# Altium project Sensors.PrjPCB
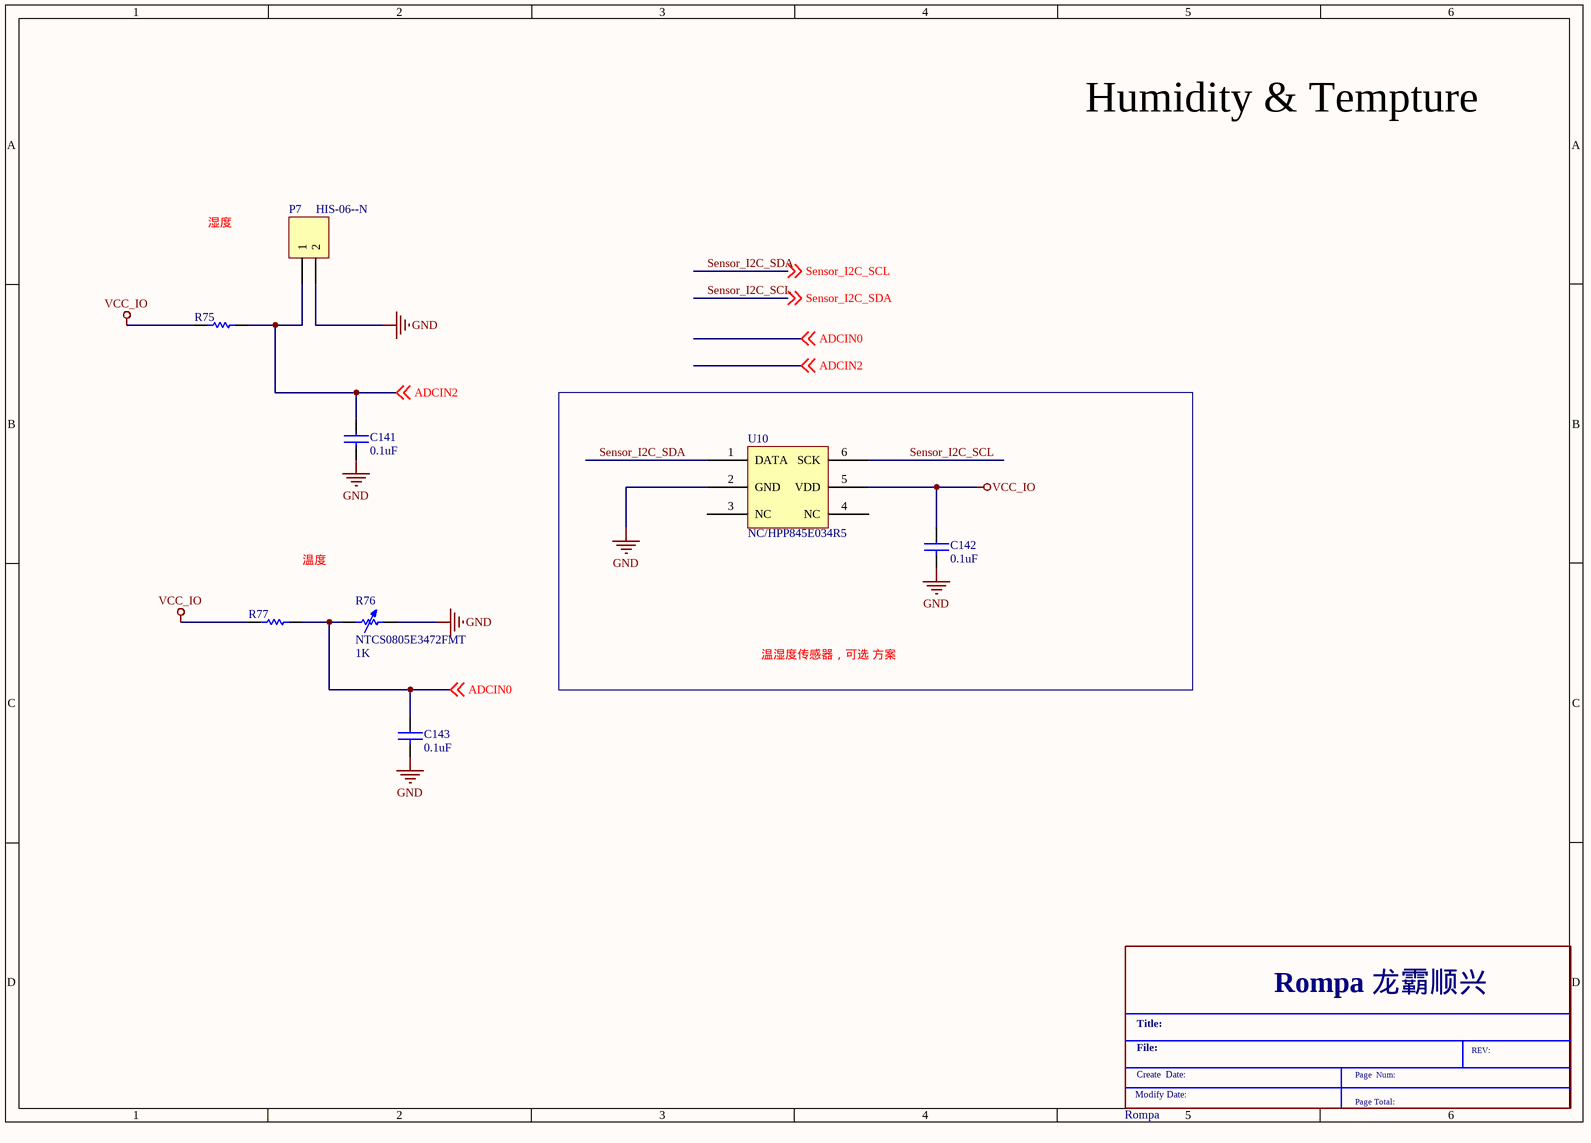
[diagram p0: Option_Humidity_Tempture_Sensor.SchDoc]
3 sheets, 20 parts. Net scope: global (net labels, ports and power ports of the same name join across sheets).
Sheets:
  Option_Humidity_Tempture_Sensor.SchDoc
  Option_LighterSensor.SchDoc
  Option_MotionSensor.SchDoc

## Sheet Option_Humidity_Tempture_Sensor.SchDoc
size 297 x 209 mm

### Parts
(Parts that share a designator on the sheet are numbered #1, #2 ... from top to bottom, then left to right.)
*#1  Rompa  (graphical)
C141  0.1uF  [C0402]
C142  0.1uF  [C0402]
C143  0.1uF  [C0402]
P7  HIS-06--N  [HDR1X2]
R75  10K  [0603]  (value not drawn)
R76  NTCS0805E3472FMT  value 1K  [2012[0805]]
R77  10K  [0603]  (value not drawn)
U10  NC/HPP845E034R5

### Blocks framed on the sheet
温湿度传感器，可选 方案: C142 U10

### Nets
GND: C141.2 C142.2 C143.2 P7.2 R76.2 U10.2(GND)
VCC_IO: C142.1 R75.2 R77.2 U10.5(VDD)
ADCIN0: C143.1 R76.1 R77.1 ; off-sheet ADCIN0
ADCIN2: C141.1 P7.1 R75.1 ; off-sheet ADCIN2
Sensor_I2C_SCL: U10.1(DATA) U10.6(SCK) ; off-sheet Sensor_I2C_SDA, off-sheet Sensor_I2C_SCL  [also labelled Sensor_I2C_SDA]

Not connected (* = marked no-connect by the designer): U10 3(NC) 4(NC)

### Notes on the sheet
- Humidity & Tempture
- 湿度
- 温度
- (in symbol Rompa) Rompa 龙霸顺兴; Title:; File:; REV:; Create  Date:; Page  Num:; Modify Date:; Page Total:

### Library data of the parts
C141-C143 = CAP NP
P7 = Header 2: Humidity Resistor; LatestRevisionDate: 17-Jul-2002; LatestRevisionNote: Re-released for DXP Platform.; Publisher: Altium Limited
R75 R77 = Res1: Resistor; Published: 8-Jun-2000; LatestRevisionDate: 17-Jul-2002; LatestRevisionNote: Re-released for DXP Platform.; PackageReference: AXIAL-0.3; Publisher: Altium Limited; Value: 10K
R76 = Res Adj1: 4K7 NTC 1%; Set Position: 0.5; Published: 8-Jun-2000; LatestRevisionDate: 17-Jul-2002; LatestRevisionNote: Re-released for DXP Platform.; PackageReference: AXIAL-0.7; Publisher: Altium Limited
U10 = HPP845E034R5

## Sheet Option_LighterSensor.SchDoc
size 297 x 209 mm
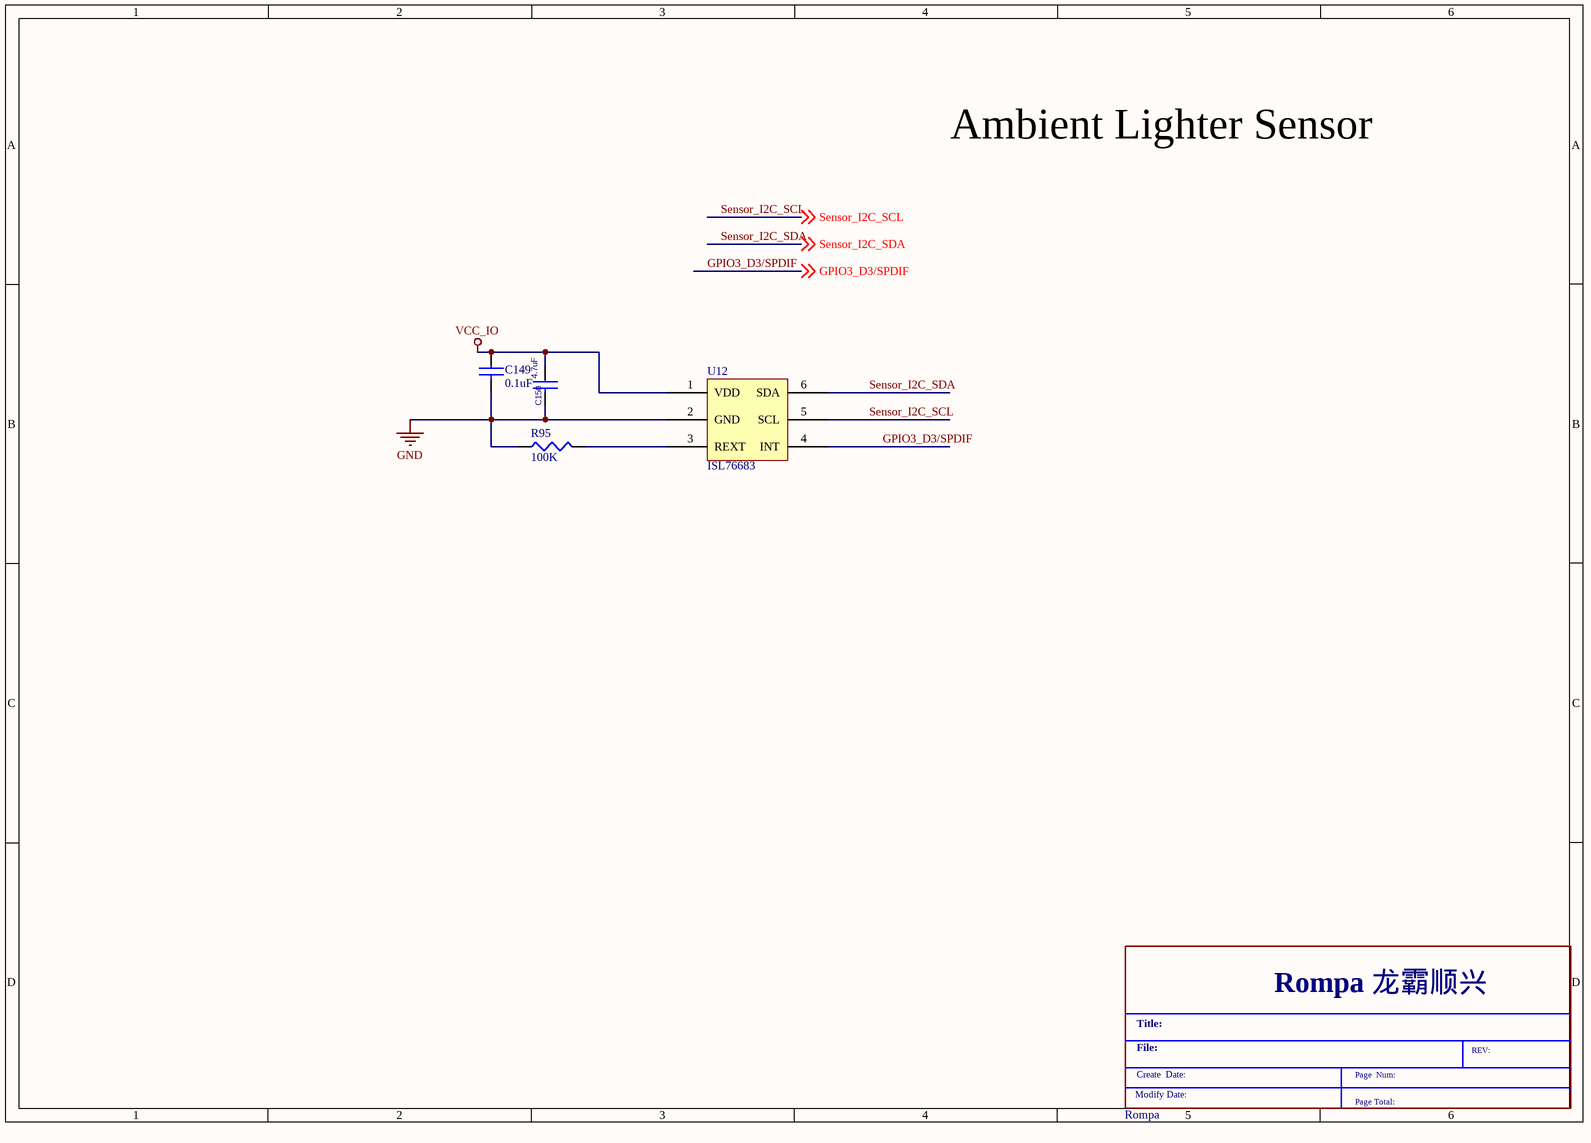
[diagram p1: Option_LighterSensor.SchDoc]

### Parts
(Parts that share a designator on the sheet are numbered #1, #2 ... from top to bottom, then left to right.)
*#2  Rompa  (graphical)
C149  0.1uF  [C0402]
C150  4.7uF  [C0603]
R95  100K  [R0402]
U12  ISL76683

### Nets
GND: C149.2 C150.2 R95.1 U12.2(GND)
VCC_IO: C149.1 C150.1 U12.1(VDD)
GPIO3_D3/SPDIF: U12.4(INT) ; off-sheet GPIO3_D3/SPDIF
Sensor_I2C_SCL: U12.5(SCL) U12.6(SDA) ; off-sheet Sensor_I2C_SDA, off-sheet Sensor_I2C_SCL  [also labelled Sensor_I2C_SDA]
NetR95_2: R95.2 U12.3(REXT)

### Notes on the sheet
- Ambient Lighter Sensor
- (in symbol Rompa) Rompa 龙霸顺兴; Title:; File:; REV:; Create  Date:; Page  Num:; Modify Date:; Page Total:

### Library data of the parts
C149 = CAP NP
C150 = CAP NP_4
R95 = RESISTOR

## Sheet Option_MotionSensor.SchDoc
size 297 x 209 mm
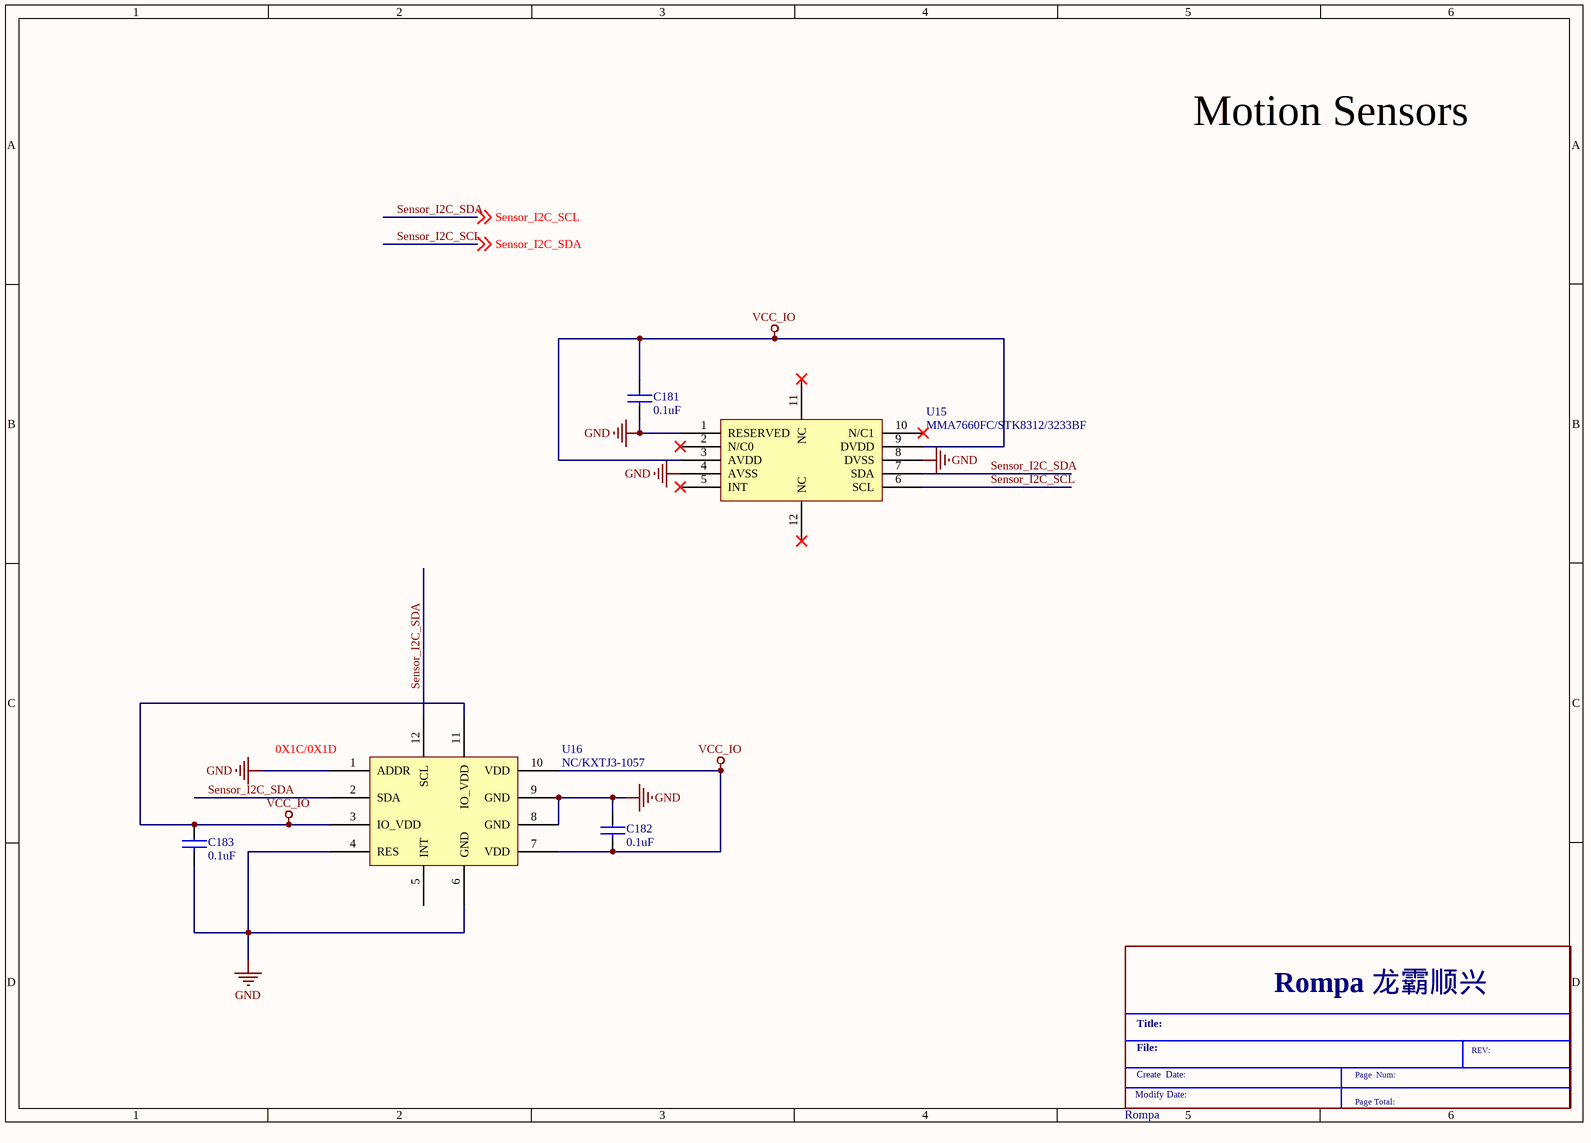
[diagram p2: Option_MotionSensor.SchDoc]

### Parts
(Parts that share a designator on the sheet are numbered #1, #2 ... from top to bottom, then left to right.)
*#3  Rompa  (graphical)
C181  0.1uF  [C0402]
C182  0.1uF  [C0402]
C183  0.1uF  [C0402]
U15  MMA7660FC/STK8312/3233BF
U16  NC/KXTJ3-1057

### Nets
GND: C181.2 C182.1 C183.2 U15.1(RESERVED) U15.4(AVSS) U15.8(DVSS) U16.1(ADDR) U16.4(RES) U16.6(GND) U16.8(GND) U16.9(GND)
VCC_IO: C181.1 C182.2 C183.1 U15.3(AVDD) U15.9(DVDD) U16.3(IO_VDD) U16.7(VDD) U16.10(VDD) U16.11(IO_VDD)
Sensor_I2C_SCL: U15.6(SCL) U15.7(SDA) U16.2(SDA) U16.12(SCL) ; off-sheet Sensor_I2C_SDA, off-sheet Sensor_I2C_SCL  [also labelled Sensor_I2C_SDA]

Not connected (* = marked no-connect by the designer): U15 2(N/C0)* 5(INT)* 10(N/C1)* 11(NC)* 12(NC)*; U16 5(INT)

### Notes on the sheet
- Motion Sensors
- (near U16) 0X1C/0X1D
- (in symbol Rompa) Rompa 龙霸顺兴; Title:; File:; REV:; Create  Date:; Page  Num:; Modify Date:; Page Total:

### Library data of the parts
C181-C183 = CAP NP
U15 = MMA7660FC
U16 = KXTJ3

## Nets that join several sheets
GND: Option_Humidity_Tempture_Sensor (6 pins), Option_LighterSensor (C149.2 C150.2 R95.1 U12.2), Option_MotionSensor (11 pins)
VCC_IO: Option_Humidity_Tempture_Sensor (C142.1 R75.2 R77.2 U10.5), Option_LighterSensor (C149.1 C150.1 U12.1), Option_MotionSensor (9 pins)
Sensor_I2C_SCL: Option_Humidity_Tempture_Sensor (U10.1 U10.6), Option_LighterSensor (U12.5 U12.6), Option_MotionSensor (U15.6 U15.7 U16.2 U16.12)